# Altium schematic sheet 摄像头小王子.SchDoc: 摄像头小王子
size A2
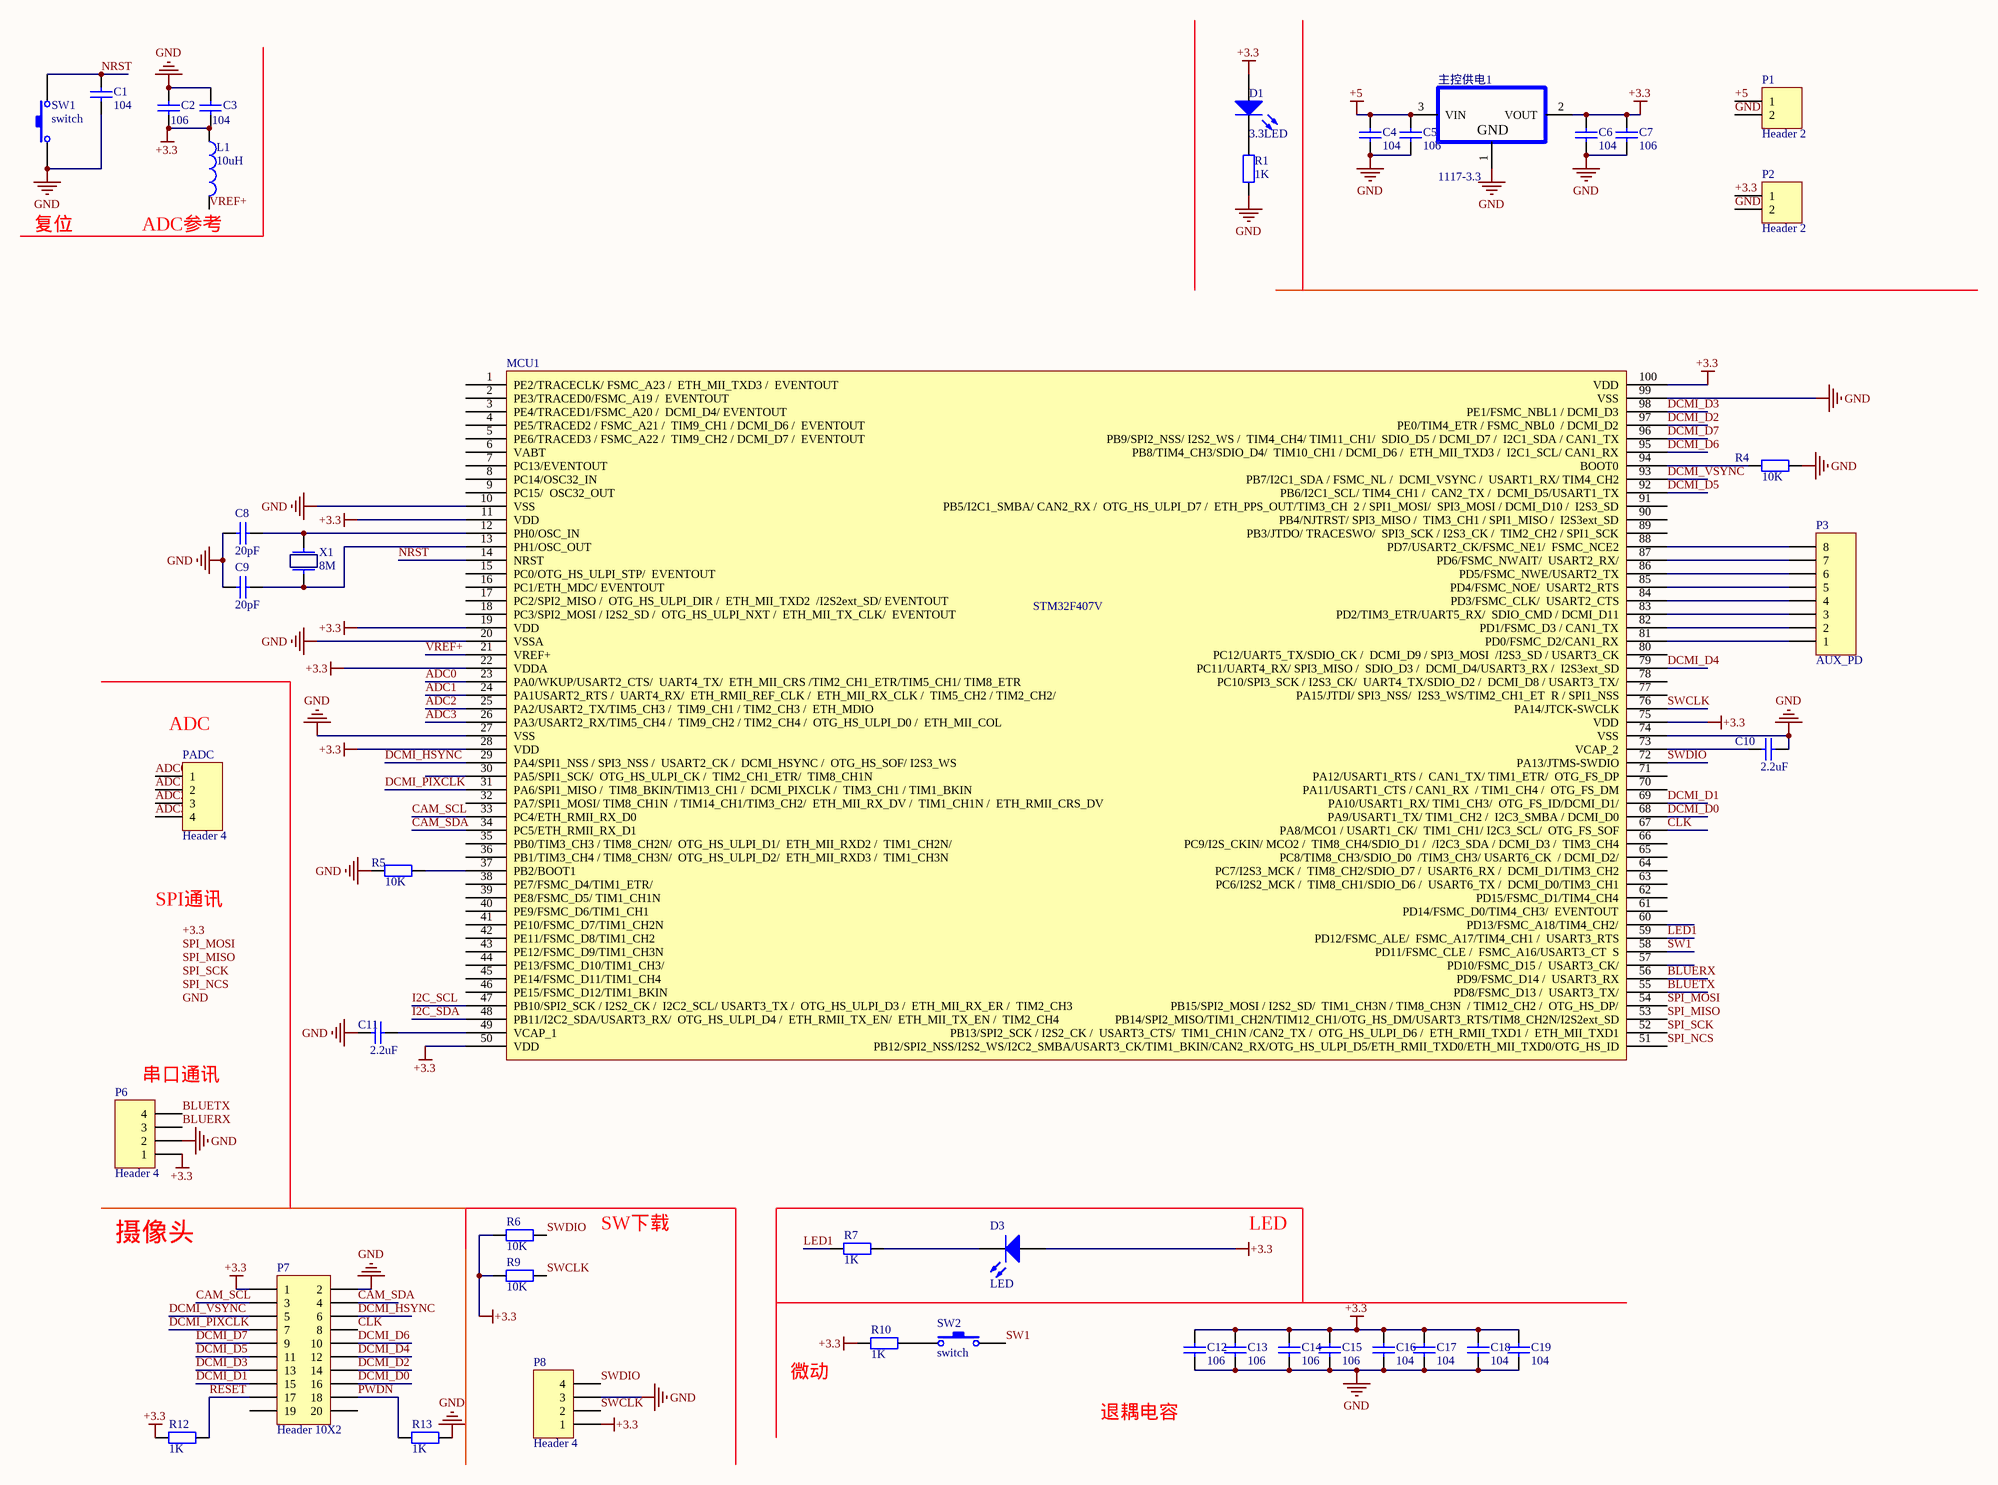
[diagram p0: 摄像头小王子.SchDoc]

## Parts
C1  104  [6-0805_N]
C2  value 106  [6-0805_N]  (hidden comment: Cap)
C3  value 104  [6-0805_N]  (hidden comment: Cap)
C4  104  [6-0805_N]
C5  106  [6-0805_N]
C6  104  [6-0805_N]
C7  106  [6-0805_N]
C8  20pF  [6-0805_N]
C9  20pF  [6-0805_N]
C10  2.2uF  [6-0805_N]
C11  2.2uF  [6-0805_N]
C12  106  [6-0805_N]
C13  106  [6-0805_N]
C14  106  [6-0805_N]
C15  106  [6-0805_N]
C16  104  [6-0805_N]
C17  104  [6-0805_N]
C18  104  [6-0805_N]
C19  104  [6-0805_N]
D1  3.3LED  [6-0805_N]
D3  LED  [6-0805_N]
L1  value 10uH  [6-0805_N]  (hidden comment: Inductor)
MCU1  STM32F407V  [LQFP100]
P1  Header 2  [HDR1X2]
P2  Header 2  [HDR1X2]
P3  AUX_PD  [HDR1X8]
P6  Header 4  [HDR1X4]
P7  Header 10X2  [HDR2X10]
P8  Header 4  [HDR1X4]
PADC  Header 4  [HDR1X4]
R1  1K  [6-0805_N]
R4  10K  [6-0805_N]
R5  10K  [6-0805_N]
R6  10K  [6-0805_N]
R7  1K  [6-0805_N]
R9  10K  [6-0805_N]
R10  1K  [6-0805_N]
R12  1K  [6-0805_N]
R13  1K  [6-0805_N]
SW1  switch  [SW_PB2_A1]
SW2  switch  [SW_PB2_A1]
X1  value 8M  [HDR1X3]  (hidden comment: xtal)
主控供电1  1117-3.3  [SOT-223]

## Nets
+3.3: C2.1 C3.1 C6.2 C7.2 C12.2 C13.2 C14.2 C15.2 C16.2 C17.2 C18.2 C19.2 D1.1(A) D3.1(A) L1.1 MCU1.11(VDD) MCU1.19(VDD) MCU1.22(VDDA) MCU1.28(VDD) MCU1.50(VDD) MCU1.75(VDD) MCU1.100(VDD) P2.1 P6.1 P7.1 P8.1 R6.1 R9.2 R10.1 R12.1 主控供电1.2(VOUT)
+5: C4.2 C5.2 P1.1 主控供电1.3(VIN)
GND: C1.1 C2.2 C3.2 C4.1 C5.1 C6.1 C7.1 C8.1 C9.1 C10.2 C11.1 C12.1 C13.1 C14.1 C15.1 C16.1 C17.1 C18.1 C19.1 MCU1.10(VSS) MCU1.20(VSSA) MCU1.27(VSS) MCU1.74(VSS) MCU1.99(VSS) P1.2 P2.2 P6.2 P7.2 P8.3 R1.1 R4.2 R5.2 R13.2 SW1.1 主控供电1.1(GND)
ADC0: MCU1.23(PA0/WKUP/USART2_CTS/__UART4_TX/__ETH_MII_CRS_/TIM2_CH1_ETR/TIM5_CH1/_TIM8_ETR) PADC.1
ADC1: MCU1.24(PA1USART2_RTS_/__UART4_RX/__ETH_RMII_REF_CLK_/__ETH_MII_RX_CLK_/__TIM5_CH2_/_TIM2_CH2/) PADC.2
ADC2: MCU1.25(PA2/USART2_TX/TIM5_CH3_/__TIM9_CH1_/_TIM2_CH3_/__ETH_MDIO) PADC.3
ADC3: MCU1.26(PA3/USART2_RX/TIM5_CH4_/__TIM9_CH2_/_TIM2_CH4_/__OTG_HS_ULPI_D0_/__ETH_MII_COL) PADC.4
BLUERX: MCU1.56(PD9/FSMC_D14_/__USART3_RX) P6.3
BLUETX: MCU1.55(PD8/FSMC_D13_/__USART3_TX/) P6.4
CAM_SCL: MCU1.33(PC4/ETH_RMII_RX_D0) P7.3
CAM_SDA: MCU1.34(PC5/ETH_RMII_RX_D1) P7.4
CLK: MCU1.67(PA8/MCO1_/_USART1_CK/__TIM1_CH1/_I2C3_SCL/__OTG_FS_SOF) P7.8
DCMI_D0: MCU1.68(PA9/USART1_TX/_TIM1_CH2_/__I2C3_SMBA_/_DCMI_D0) P7.16
DCMI_D1: MCU1.69(PA10/USART1_RX/_TIM1_CH3/__OTG_FS_ID/DCMI_D1/) P7.15
DCMI_D2: MCU1.97(PE0/TIM4_ETR_/_FSMC_NBL0__/_DCMI_D2) P7.14
DCMI_D3: MCU1.98(PE1/FSMC_NBL1_/_DCMI_D3) P7.13
DCMI_D4: MCU1.79(PC11/UART4_RX/_SPI3_MISO_/__SDIO_D3_/__DCMI_D4/USART3_RX_/__I2S3ext_SD) P7.12
DCMI_D5: MCU1.92(PB6/I2C1_SCL/_TIM4_CH1_/__CAN2_TX_/__DCMI_D5/USART1_TX) P7.11
DCMI_D6: MCU1.95(PB8/TIM4_CH3/SDIO_D4/__TIM10_CH1_/_DCMI_D6_/__ETH_MII_TXD3_/__I2C1_SCL/_CAN1_RX) P7.10
DCMI_D7: MCU1.96(PB9/SPI2_NSS/_I2S2_WS_/__TIM4_CH4/_TIM11_CH1/__SDIO_D5_/_DCMI_D7_/__I2C1_SDA_/_CAN1_TX) P7.9
DCMI_HSYNC: MCU1.29(PA4/SPI1_NSS_/_SPI3_NSS_/__USART2_CK_/__DCMI_HSYNC_/__OTG_HS_SOF/_I2S3_WS) P7.6
DCMI_PIXCLK: MCU1.31(PA6/SPI1_MISO_/__TIM8_BKIN/TIM13_CH1_/__DCMI_PIXCLK_/__TIM3_CH1_/_TIM1_BKIN) P7.7
DCMI_VSYNC: MCU1.93(PB7/I2C1_SDA_/_FSMC_NL_/__DCMI_VSYNC_/__USART1_RX/_TIM4_CH2) P7.5
I2C_SCL: MCU1.47(PB10/SPI2_SCK_/_I2S2_CK_/__I2C2_SCL/_USART3_TX_/__OTG_HS_ULPI_D3_/__ETH_MII_RX_ER_/__TIM2_CH3)
I2C_SDA: MCU1.48(PB11/I2C2_SDA/USART3_RX/__OTG_HS_ULPI_D4_/__ETH_RMII_TX_EN/__ETH_MII_TX_EN_/__TIM2_CH4)
LED1: MCU1.59(PD12/FSMC_ALE/__FSMC_A17/TIM4_CH1_/__USART3_RTS) R7.1
NRST: C1.2 MCU1.14(NRST) SW1.2
PWDN: P7.18 R13.1
RESET: P7.17 R12.2
SPI_MISO: MCU1.53(PB14/SPI2_MISO/TIM1_CH2N/TIM12_CH1/OTG_HS_DM/USART3_RTS/TIM8_CH2N/I2S2ext_SD)
SPI_MOSI: MCU1.54(PB15/SPI2_MOSI_/_I2S2_SD/__TIM1_CH3N_/_TIM8_CH3N__/_TIM12_CH2_/__OTG_HS_DP/)
SPI_NCS: MCU1.51(PB12/SPI2_NSS/I2S2_WS/I2C2_SMBA/USART3_CK/TIM1_BKIN/CAN2_RX/OTG_HS_ULPI_D5/ETH_RMII_TXD0/ETH_MII_TXD0/OTG_HS_ID)
SPI_SCK: MCU1.52(PB13/SPI2_SCK_/_I2S2_CK_/__USART3_CTS/__TIM1_CH1N_/CAN2_TX_/__OTG_HS_ULPI_D6_/__ETH_RMII_TXD1_/__ETH_MII_TXD1)
SW1: MCU1.58(PD11/FSMC_CLE_/__FSMC_A16/USART3_CT__S) SW2.2
SWCLK: MCU1.76(PA14/JTCK-SWCLK) P8.2 R9.1
SWDIO: MCU1.72(PA13/JTMS-SWDIO) P8.4 R6.2
VREF+: L1.2 MCU1.21(VREF+)
NetC8_2: C8.2 MCU1.12(PH0/OSC_IN) X1.2
NetC9_2: C9.2 MCU1.13(PH1/OSC_OUT) X1.1
NetC10_1: C10.1 MCU1.73(VCAP_2)
NetC11_2: C11.2 MCU1.49(VCAP_1)
NetD1_2: D1.2(K) R1.2
NetD3_2: D3.2(K) R7.2
NetMCU1_37: MCU1.37(PB2/BOOT1) R5.1
NetMCU1_81: MCU1.81(PD0/FSMC_D2/CAN1_RX) P3.1
NetMCU1_82: MCU1.82(PD1/FSMC_D3_/_CAN1_TX) P3.2
NetMCU1_83: MCU1.83(PD2/TIM3_ETR/UART5_RX/__SDIO_CMD_/_DCMI_D11) P3.3
NetMCU1_84: MCU1.84(PD3/FSMC_CLK/__USART2_CTS) P3.4
NetMCU1_85: MCU1.85(PD4/FSMC_NOE/__USART2_RTS) P3.5
NetMCU1_86: MCU1.86(PD5/FSMC_NWE/USART2_TX) P3.6
NetMCU1_87: MCU1.87(PD6/FSMC_NWAIT/__USART2_RX/) P3.7
NetMCU1_88: MCU1.88(PD7/USART2_CK/FSMC_NE1/__FSMC_NCE2) P3.8
NetMCU1_94: MCU1.94(BOOT0) R4.1
NetR10_2: R10.2 SW2.1

Not connected (* = marked no-connect by the designer): MCU1 1(PE2/TRACECLK/_FSMC_A23_/__ETH_MII_TXD3_/__EVENTOUT) 2(PE3/TRACED0/FSMC_A19_/__EVENTOUT) 3(PE4/TRACED1/FSMC_A20_/__DCMI_D4/_EVENTOUT) 4(PE5/TRACED2_/_FSMC_A21_/__TIM9_CH1_/_DCMI_D6_/__EVENTOUT) 5(PE6/TRACED3_/_FSMC_A22_/__TIM9_CH2_/_DCMI_D7_/__EVENTOUT) 6(VABT) 7(PC13/EVENTOUT) 8(PC14/OSC32_IN) 9(PC15/__OSC32_OUT) 15(PC0/OTG_HS_ULPI_STP/__EVENTOUT) 16(PC1/ETH_MDC/_EVENTOUT) 17(PC2/SPI2_MISO_/__OTG_HS_ULPI_DIR_/__ETH_MII_TXD2__/I2S2ext_SD/_EVENTOUT) 18(PC3/SPI2_MOSI_/_I2S2_SD_/__OTG_HS_ULPI_NXT_/__ETH_MII_TX_CLK/__EVENTOUT) 30(PA5/SPI1_SCK/__OTG_HS_ULPI_CK_/__TIM2_CH1_ETR/__TIM8_CH1N) 32(PA7/SPI1_MOSI/_TIM8_CH1N__/_TIM14_CH1/TIM3_CH2/__ETH_MII_RX_DV_/__TIM1_CH1N_/__ETH_RMII_CRS_DV) 35(PB0/TIM3_CH3_/_TIM8_CH2N/__OTG_HS_ULPI_D1/__ETH_MII_RXD2_/__TIM1_CH2N/) 36(PB1/TIM3_CH4_/_TIM8_CH3N/__OTG_HS_ULPI_D2/__ETH_MII_RXD3_/__TIM1_CH3N) 38(PE7/FSMC_D4/TIM1_ETR/) 39(PE8/FSMC_D5/_TIM1_CH1N) 40(PE9/FSMC_D6/TIM1_CH1) 41(PE10/FSMC_D7/TIM1_CH2N) 42(PE11/FSMC_D8/TIM1_CH2) 43(PE12/FSMC_D9/TIM1_CH3N) 44(PE13/FSMC_D10/TIM1_CH3/) 45(PE14/FSMC_D11/TIM1_CH4) 46(PE15/FSMC_D12/TIM1_BKIN) 57(PD10/FSMC_D15_/__USART3_CK/) 60(PD13/FSMC_A18/TIM4_CH2/) 61(PD14/FSMC_D0/TIM4_CH3/__EVENTOUT) 62(PD15/FSMC_D1/TIM4_CH4) 63(PC6/I2S2_MCK_/__TIM8_CH1/SDIO_D6_/__USART6_TX_/__DCMI_D0/TIM3_CH1) 64(PC7/I2S3_MCK_/__TIM8_CH2/SDIO_D7_/__USART6_RX_/__DCMI_D1/TIM3_CH2) 65(PC8/TIM8_CH3/SDIO_D0__/TIM3_CH3/_USART6_CK__/_DCMI_D2/) 66(PC9/I2S_CKIN/_MCO2_/__TIM8_CH4/SDIO_D1_/__/I2C3_SDA_/_DCMI_D3_/__TIM3_CH4) 70(PA11/USART1_CTS_/_CAN1_RX__/_TIM1_CH4_/__OTG_FS_DM) 71(PA12/USART1_RTS_/__CAN1_TX/_TIM1_ETR/__OTG_FS_DP) 77(PA15/JTDI/_SPI3_NSS/__I2S3_WS/TIM2_CH1_ET__R_/_SPI1_NSS) 78(PC10/SPI3_SCK_/_I2S3_CK/__UART4_TX/SDIO_D2_/__DCMI_D8_/_USART3_TX/) 80(PC12/UART5_TX/SDIO_CK_/__DCMI_D9_/_SPI3_MOSI__/I2S3_SD_/_USART3_CK) 89(PB3/JTDO/_TRACESWO/__SPI3_SCK_/_I2S3_CK_/__TIM2_CH2_/_SPI1_SCK) 90(PB4/NJTRST/_SPI3_MISO_/__TIM3_CH1_/_SPI1_MISO_/__I2S3ext_SD) 91(PB5/I2C1_SMBA/_CAN2_RX_/__OTG_HS_ULPI_D7_/__ETH_PPS_OUT/TIM3_CH__2_/_SPI1_MOSI/__SPI3_MOSI_/_DCMI_D10_/__I2S3_SD); P7 19 20

## Notes on the sheet
- 复位
- (near L1) ADC参考
- (near PADC) ADC
- SPI通讯
- (near P6) 串口通讯
- 摄像头
- SW下载
- LED
- 微动
- 退耦电容
- Labels drawn without touching a wire or pin: +3.3, GND, SPI_MISO, SPI_MOSI, SPI_NCS, SPI_SCK

## Library data of the parts
C1 C4-C19 = cap: value: 10uF
C2 C3 = Cap: Capacitor; Published: 8-Jun-2000; LatestRevisionDate: 17-Jul-2002; LatestRevisionNote: Re-released for DXP Platform.; PackageReference: RAD-0.3; Publisher: Altium Limited; PackageDescription: Radial Cap, Thru-Hole; 2 Leads; 0.3 in Pin Spacing
D1 = LED
L1 = Inductor: Code_IEC: 1005; Published: 8-Jun-2000; LatestRevisionDate: 29-May-2009; LatestRevisionNote: IPC-7351 Footprint Added.; PackageReference: 0402-A; Publisher: Altium Limited; PackageDescription: Chip Inductor; Code_JEITA: 0402
MCU1 = stm32f407
P1 P2 = Header 2: Header, 2-Pin; LatestRevisionDate: 17-Jul-2002; LatestRevisionNote: Re-released for DXP Platform.; Publisher: Altium Limited
P3 = Header 8: Header, 8-Pin; LatestRevisionDate: 17-Jul-2002; LatestRevisionNote: Re-released for DXP Platform.; Publisher: Altium Limited
P6 P8 PADC = Header 4: Header, 4-Pin; LatestRevisionDate: 17-Jul-2002; LatestRevisionNote: Re-released for DXP Platform.; Publisher: Altium Limited
P7 = Header 10X2: Header, 10-Pin, Dual row; LatestRevisionDate: 17-Jul-2002; LatestRevisionNote: Re-released for DXP Platform.; Publisher: Altium Limited
R1 R7 R10 R12 R13 = resistor: small resistor; value: 1K
R4-R6 R9 = resistor: small resistor; value: 1K
SW1 SW2 = switch-1
主控供电1 = 1117M3-3.3